# EAGLE design Mini_Matrix_v2 (EAGLE 6.1)
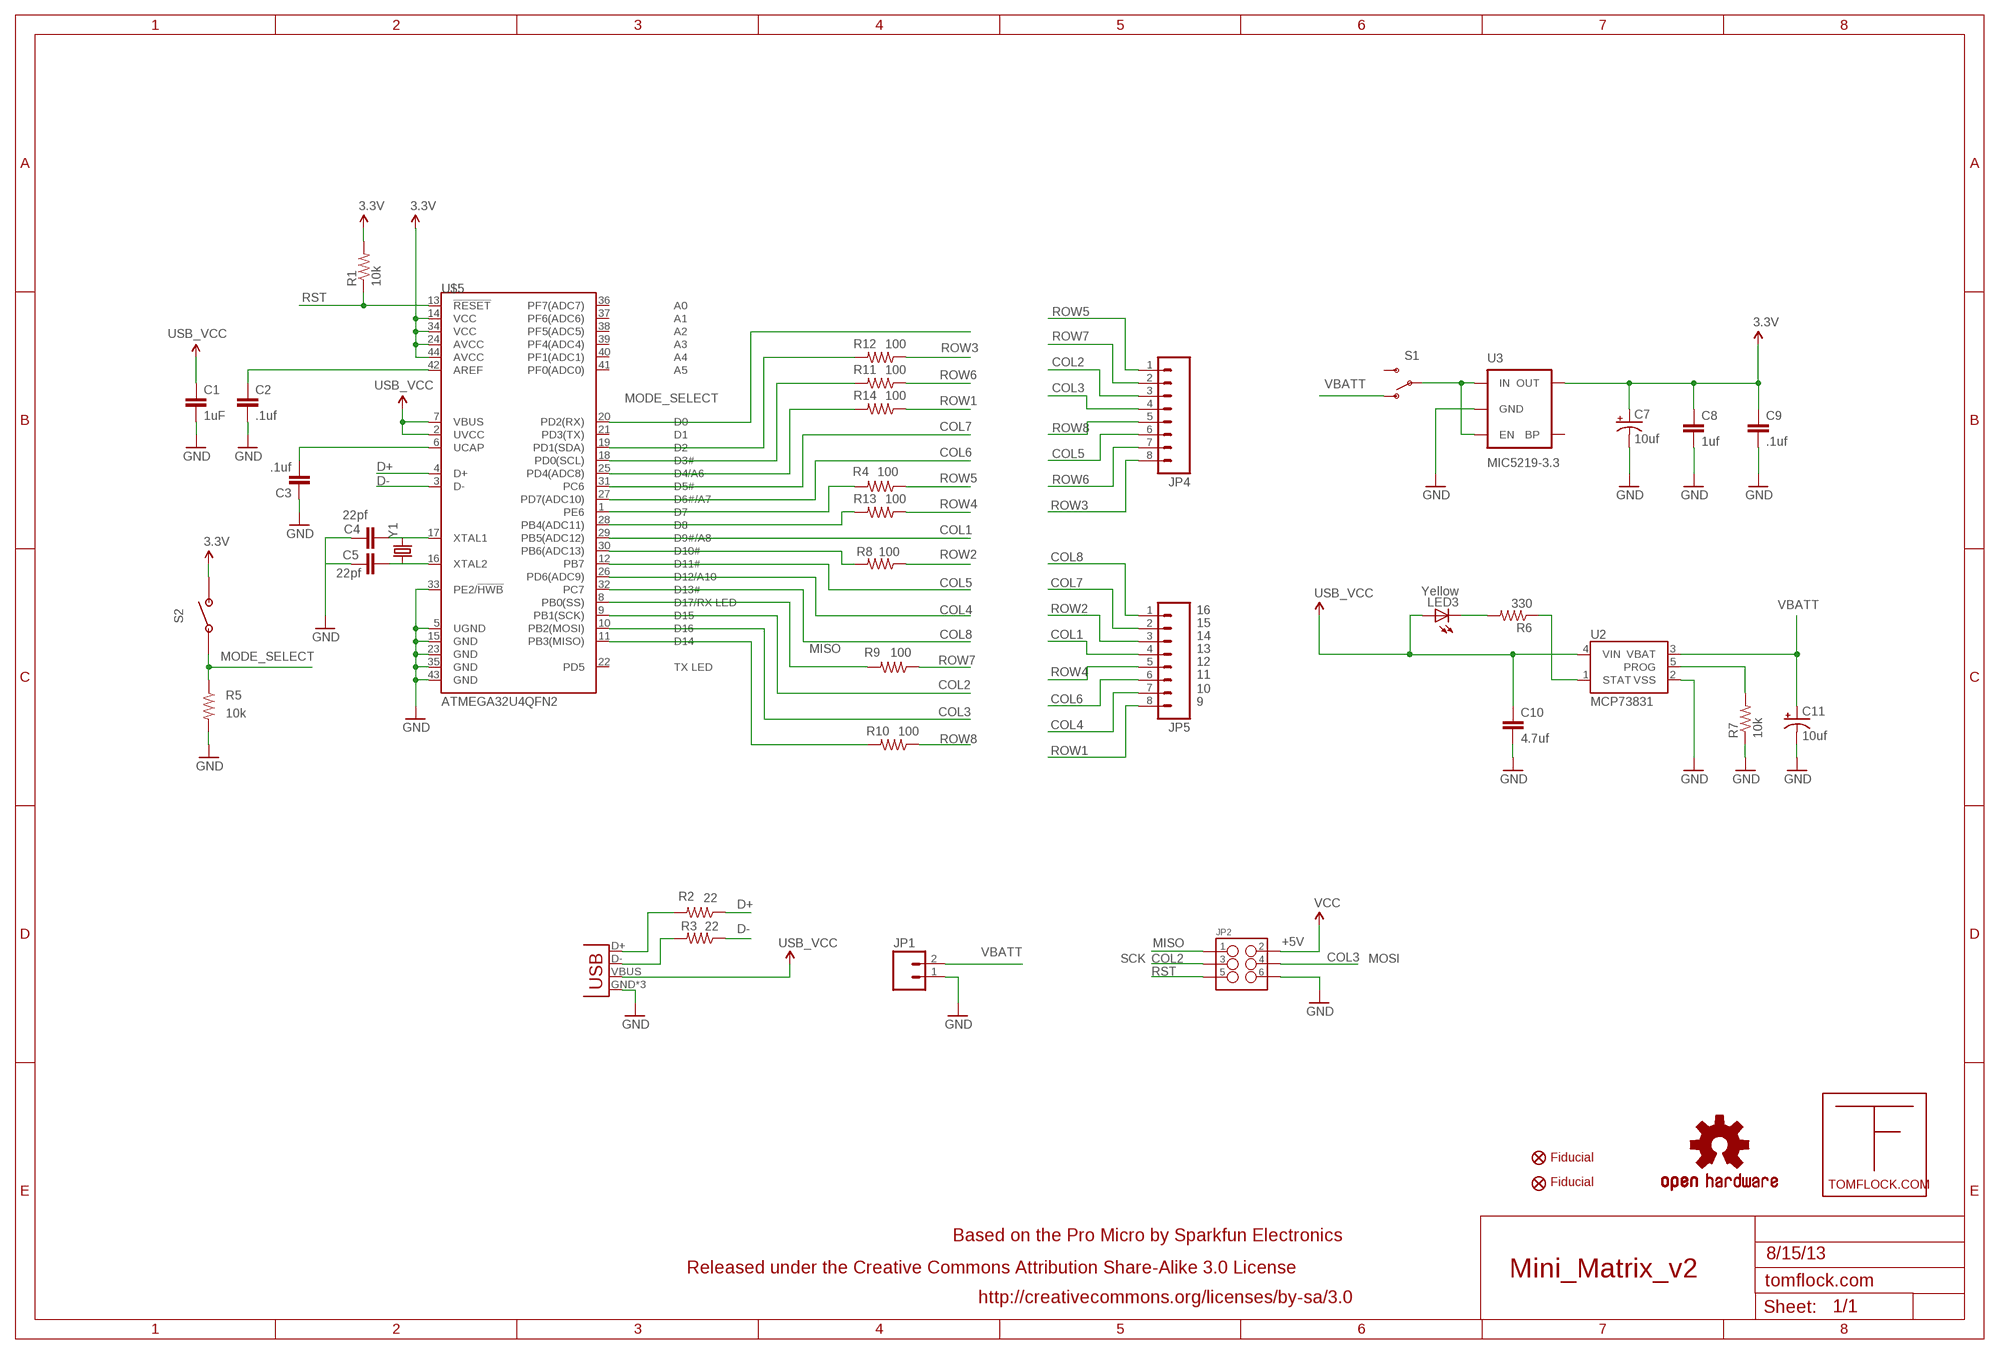
[diagram p0: schematic, sheet 1]

## Parts
C1  1uF  CAP0402-CAP  [0402-CAP]
C2  .1uf  CAP0402-CAP  [0402-CAP]
C3  .1uf  CAP0402-CAP  [0402-CAP]
C4  22pf  CAP0402-CAP  [0402-CAP]
C5  22pf  CAP0402-CAP  [0402-CAP]
C7  10uf  CAP_POL1206  [EIA3216]
C8  1uf  CAP0402-CAP  [0402-CAP]
C9  .1uf  CAP0402-CAP  [0402-CAP]
C10  4.7uf  CAP0402-CAP  [0402-CAP]
C11  10uf  CAP_POL1206  [EIA3216]
JP1  M02-JST-2-PTH-NO_SILK  [JST-2-PTH-NS]
JP2  M03X22X3_SILK_SM  [2X3]
JP3  USB-MICROB  [USB-MICROB]
JP4  M08SMD-STRAIGHT  [1X08_SMD]
JP5  M08SMD-STRAIGHT  [1X08_SMD]
JP6  FIDUCIAL1.5X3  [FIDUCIAL-1.5X3]
JP7  FIDUCIAL1.5X3  [FIDUCIAL-1.5X3]
LED3  Yellow  LED0603  [LED-0603]
R1  10k  RESISTOR0402-RES  [0402-RES]
R2  22  RESISTOR0402-RES  [0402-RES]
R3  22  RESISTOR0402-RES  [0402-RES]
R4  100  RESISTOR0402-RES  [0402-RES]
R5  10k  RESISTOR0402-RES  [0402-RES]
R6  330  RESISTOR0402-RES  [0402-RES]
R7  10k  RESISTOR0402-RES  [0402-RES]
R8  100  RESISTOR0402-RES  [0402-RES]
R9  100  RESISTOR0402-RES  [0402-RES]
R10  100  RESISTOR0402-RES  [0402-RES]
R11  100  RESISTOR0402-RES  [0402-RES]
R12  100  RESISTOR0402-RES  [0402-RES]
R13  100  RESISTOR0402-RES  [0402-RES]
R14  100  RESISTOR0402-RES  [0402-RES]
S1  SWITCH-SPST-SMD-A  [SWITCH-SPST-SMD-A]
S2  SWITCH-RIGHT-ANGLE-SMD  [SWITCH-RIGHT-ANGLE-SMD]
U2  MCP73831  [SOT23-5]
U3  MIC5219-3.3  V_REG_LDOSMD  [SOT23-5]
U$1  TFLOGO  [TFLOGO]
U$2  OSHW-LOGOS  [OSHW-LOGO-S]
U$5  ATMEGA32U4QFN2  [SPARKFUN-DIGITALIC_QFN-44-NOPAD]
Y1  CRYSTAL5X3  [CRYSTAL-SMD-5X3]

## Nets
3.3V: C7.A(+) C8.1 C9.1 JP2.2 R1.2 S2.2 U3.5(OUT) U$5.14(VCC) U$5.24(AVCC) U$5.34(VCC) U$5.44(AVCC) ; supply symbol labelled VCC
COL1: JP5.4 U$5.29(PB5(ADC12))
COL2: JP2.3 JP4.3 U$5.9(PB1(SCK))
COL3: JP2.4 JP4.4 U$5.10(PB2(MOSI))
COL4: JP5.7 U$5.26(PD6(ADC9))
COL5: JP4.6 U$5.12(PB7)
COL6: JP5.6 U$5.27(PD7(ADC10))
COL7: JP5.2 U$5.31(PC6)
COL8: JP5.1 U$5.32(PC7)
D+: R2.1 U$5.4(D+)
D-: R3.1 U$5.3(D-)
GND: C1.2 C2.2 C3.1 C4.1 C5.1 C7.C(-) C8.2 C9.2 C10.2 C11.C(-) JP1.1 JP2.6 JP3.GND JP3.MT1(GND) JP3.MT2(GND) R5.2 R7.1 U2.2(VSS) U3.2(GND) U$5.5(UGND) U$5.15(GND) U$5.23(GND) U$5.33(PE2/!HWB) U$5.35(GND) U$5.43(GND)
MISO: JP2.1 R10.2 U$5.11(PB3(MISO))
MODE_SELECT: R5.1 S2.1 U$5.20(PD2(RX))
N$1: S1.2(P) U3.1(IN) U3.3(EN)
N$2: C5.2 U$5.16(XTAL2) Y1.1
N$3: R7.2 U2.5(PROG)
N$4: C4.2 U$5.17(XTAL1) Y1.3
N$5: C2.1 U$5.42(AREF)
N$6: R6.1 U2.1(STAT)
N$7: LED3.C R6.2
N$8: C3.2 U$5.6(UCAP)
N$10: R4.2 U$5.1(PE6)
N$11: R9.2 U$5.8(PB0(SS))
N$12: R11.2 U$5.18(PD0(SCL))
N$13: R12.2 U$5.19(PD1(SDA))
N$14: JP3.D- R3.2
N$15: JP3.D+ R2.2
N$16: R8.2 U$5.30(PB6(ADC13))
N$17: R13.2 U$5.28(PB4(ADC11))
N$18: R14.2 U$5.25(PD4(ADC8))
ROW1: JP5.8 R14.1
ROW2: JP5.3 R8.1
ROW3: JP4.8 R12.1
ROW4: JP5.5 R13.1
ROW5: JP4.1 R4.1
ROW6: JP4.7 R11.1
ROW7: JP4.2 R9.1
ROW8: JP4.5 R10.1
RST: JP2.5 R1.1 U$5.13(!RESET)
VBATT: C11.A(+) JP1.2 S1.1(O) U2.3(VBAT)
VCC: C1.1 C10.1 JP3.VBUS LED3.A U2.4(VIN) U$5.2(UVCC) U$5.7(VBUS) ; supply symbol labelled USB_VCC
Unconnected: S1.3(S) U3.4(BP) U$5.21(PD3(TX)) U$5.22(PD5) U$5.36(PF7(ADC7)) U$5.37(PF6(ADC6)) U$5.38(PF5(ADC5)) U$5.39(PF4(ADC4)) U$5.40(PF1(ADC1)) U$5.41(PF0(ADC0))

## Notes on the sheet
- 16
- 15
- 14
- 13
- 12
- 11
- 10
- 9
- +5V
- SCK | MOSI
- Fiducial
- Fiducial
- Based on the Pro Micro by Sparkfun Electronics
- 8/15/13
- Released under the Creative Commons Attribution Share-Alike 3.0 License
- tomflock.com
- http://creativecommons.org/licenses/by-sa/3.0

## Library data of the parts
C1-C5 C8-C10 = SparkFun:CAP: Capacitor Standard 0603 ceramic capacitor, and 0.1" leaded capacitor.
C7 C11 = SparkFun:CAP_POL: Capacitor Polarized These are standard SMD and PTH capacitors. Normally 10uF, 47uF, and 100uF in electrolytic and tantalum varieties. Always verify the external diameter of the through hole cap, it varies with capacity, voltage, and manufacturer. The EIA devices should be standard.
JP1 = SparkFun:M02: Header 2 Standard 2-pin 0.1" header. Use with straight break away headers (SKU : PRT-00116), right angle break away headers (PRT-00553), swiss pins (PRT-00743), machine pins (PRT-00117), and female headers (PRT-00115). Molex polarized connector foot print use with SKU : PRT-08233 with associated crimp pins and housings.
JP2 = SparkFun-Connectors:M03X2: 2x3 .1" header. Shrouded, with keying- CONN-10681 SMT- CONN-11415 Pogo pins- HW-11044
JP3 = SparkFun-Connectors:USB: USB Connectors USB-B-PTH is fully proven SKU : PRT-00139/CONN-08278 USB-miniB is fully proven SKU : PRT-00587 USB-A-PCB is untested. USB-A-H is throughly reviewed, but untested. Spark Fun Electronics SKU : PRT-00437 USB-B-SMT is throughly reviewed, but untested. Needs silkscreen touching up. USB-A-S has not been used/tested USB-MB-H has not been used/tested USB-MICROB has been used. CONN-09505; PROD_ID: CONN-09505
JP4 JP5 = SparkFun-Connectors:M08: Header 8 Standard 8-pin 0.1" header. Use with straight break away headers (SKU : PRT-00116), right angle break away headers (PRT-00553), swiss pins (PRT-00743), machine pins (PRT-00117), and female headers (PRT-00115).
JP6 JP7 = SparkFun:FIDUCIAL: Fiducial Alignment Points Various fiducial points for machine vision alignment.
LED3 = SparkFun:LED: LEDs Standard schematic elements and footprints for 5mm, 3mm, 1206, and 0603 sized LEDs. 5mm - Spark Fun Electronics SKU : COM-00529 (and others)
R1-R14 = SparkFun:RESISTOR: Resistor Basic schematic elements and footprints for 0603, 1206, and PTH resistors.
S1 = SparkFun:SWITCH-SPST: SPST Switch Simple slide switch. Spark Fun Electronics SKU : COM-00102
S2 = TOM1:SWITCH-RIGHT-ANGLE-SMD: B3U-3000P SWITCH TACTILE SPST-NO 0.05A 12V
U2 = SparkFun:MCP73831: Microchip's MCP73831 Miniature single cell, fully integrated Li-Ion, Li-polymer charge management controller http://ww1.microchip.com/downloads/en/DeviceDoc/21984a.pdf
U3 = SparkFun:V_REG_LDO: Voltage Regulator LDO Standard 150mA LDO voltage regulator in SOT-23 layout. Micrel part MIC5205. BP (by-pass) pin is used to lower output noise with 470pF cap.
U$1 = TOM1:TFLOGO
U$2 = SparkFun:OSHW-LOGO: Open Source Hardware Logo This logo indicates the piece of hardware it is found on incorporates a OSHW license and/or adheres to the definition of open source hardware found here: http://freedomdefined.org/OSHW
U$5 = SparkFun-DigitalIC:ATMEGA32U4: Atmel 44-pin 8-bit Microcontroller with 32KBytes of ISP Flash and USB Controller ----- Please use the QFN-44-NOPAD_1:1 package for the footprint of all boards using a 32U4. Route traces directly away from the pads as much as possible.
Y1 = SparkFun:CRYSTAL: Crystals Various standard crystals. Proven footprints. Spark Fun Electronics SKU : COM-00534

## Board
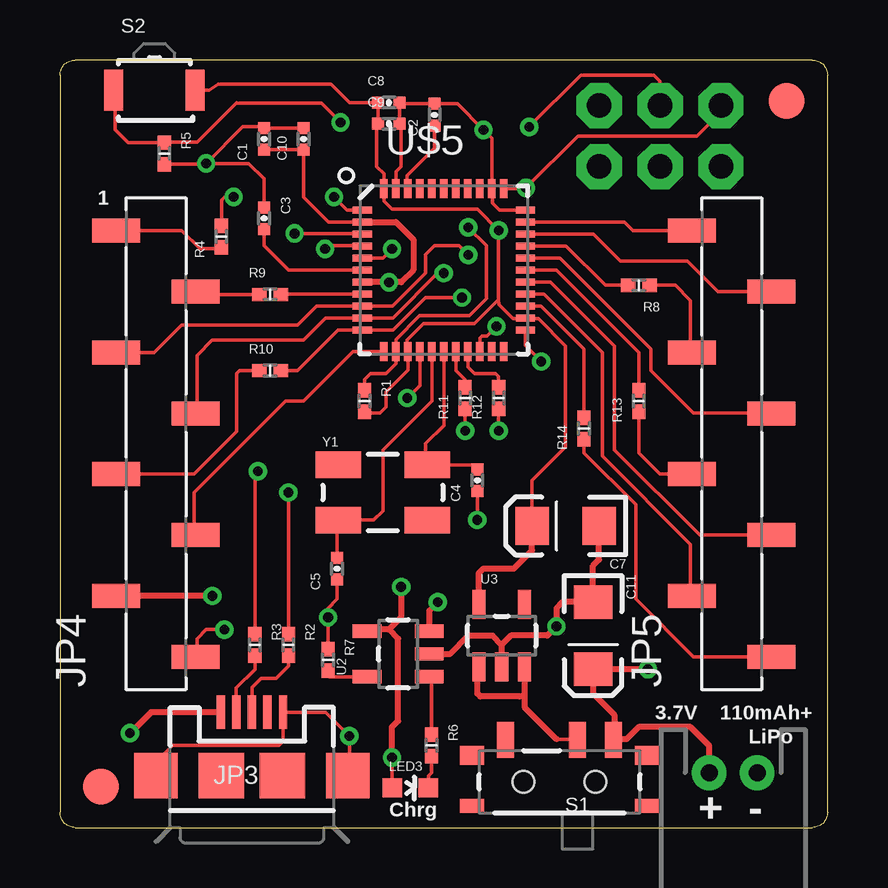
[diagram p1: board, top side]
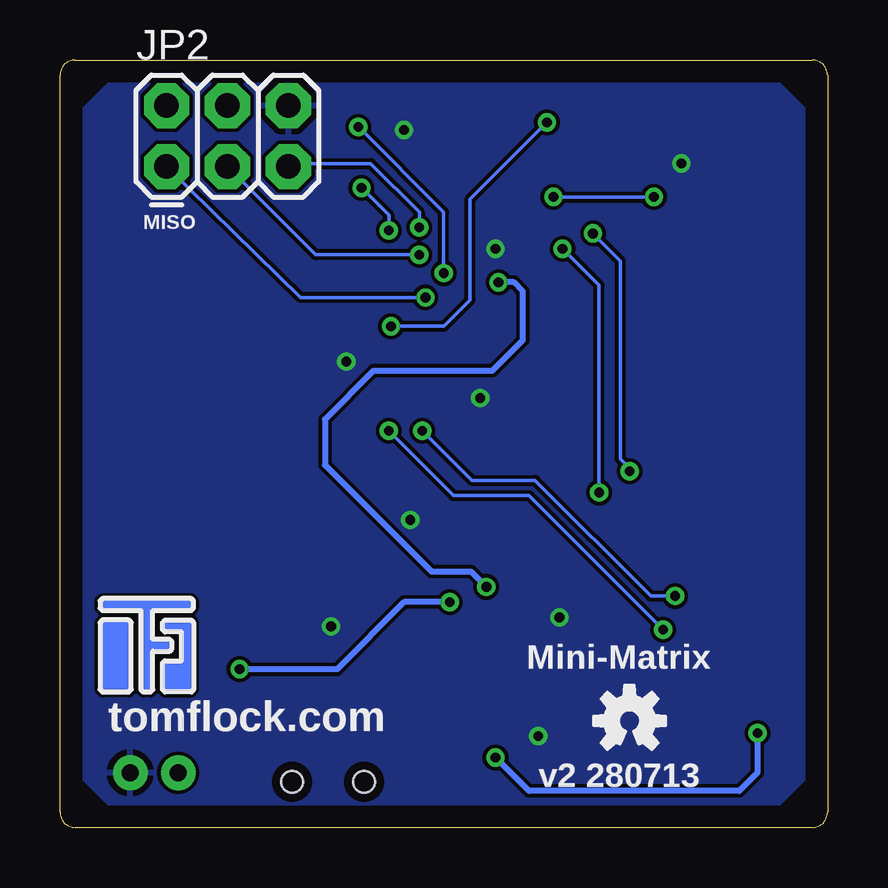
[diagram p2: board, bottom side, seen from below]

Size 32 x 32 mm. Coordinates in mm from the lower left corner, seen from the top.
Outline: 0.64,0 31.36,0 arc90 32,0.64 32,31.36 arc90 31.36,32 0.64,32 arc90 0,31.36 0,0.64 arc90 0.64,0
Copper layers (1*16): Top 0.0356mm / dielectric 1.5011mm / Bottom 0.0356mm
Design rules: minimum track width 6mil, minimum drill 13mil, track to track 6mil, track to pad 6mil, pad to pad 6mil, via to via 6mil, smd to smd 6mil, copper to edge 15mil, drill to drill 6mil, minimum pad ring 7mil, minimum via ring 7mil, stop-mask expansion 4mm, vias tented up to drill 4mm, thermal gap 10mil

### Footprints (pad centres in the part's own frame; a part is rotated, then mirrored left to right if it is on the bottom)
0402-CAP = smd 0.5 x 0.5: 1 -0.45,0; 2 0.45,0
EIA3216 = smd 1.4 x 1.6: A 1.4,0; C -1.4,0
JST-2-PTH-NS = drill 0.7 pad 1.448: 1 -1,0; 2 1,0
2X3 = drill 1.016 pad 1.88 octagon: 1 0,0; 2 0,2.54; 3 2.54,0; 4 2.54,2.54; 5 5.08,0; 6 5.08,2.54
USB-MICROB = smd 0.35 x 1.4: D+ 0,2.65; D- -0.65,2.65; GND 1.3,2.65; ID 0.65,2.65; VBUS -1.3,2.65 | smd 1.8 x 1.9: MT1 -4,0; MT2 4,0 | smd 1.9 x 1.9: P$1 -1.27,0; P$2 1.27,0
1X08_SMD = smd 1 x 2: 1 0,1.65; 2 -2.54,-1.65; 3 -5.08,1.65; 4 -7.62,-1.65; 5 -10.16,1.65; 6 -12.7,-1.65; 7 -15.24,1.65; 8 -17.78,-1.65
FIDUCIAL-1.5X3 = smd 1.5 x 1.5: 1 0,0
LED-0603 = smd 0.8 x 0.8: A 0,-0.75; C 0,0.75
0402-RES = smd 0.6 x 0.55: 1 -0.45,0; 2 0.45,0
SWITCH-SPST-SMD-A = smd 0.7 x 1.5: 1 -2.25,-1.75; 2 -0.75,-1.75; 3 2.25,-1.75 | smd 1 x 0.6: GND1 -3.65,1; GND3 3.65,1 | smd 1 x 0.8: GND2 -3.65,-1.1; GND4 3.65,-1.1 | hole 0.9: -1.5,0; 1.5,0
SWITCH-RIGHT-ANGLE-SMD = smd 0.8 x 1.7: 1 -1.7,0; 2 1.7,0
SOT23-5 = smd 0.55 x 1.2: 1 -0.95,-1.3; 2 0,-1.3; 3 0.95,-1.3; 4 0.95,1.3; 5 -0.95,1.3
SPARKFUN-DIGITALIC_QFN-44-NOPAD = smd 0.8 x 0.3: 1 -3.4,2.5; 2 -3.4,2; 3 -3.4,1.5; 4 -3.4,1; 5 -3.4,0.5; 6 -3.4,0; 7 -3.4,-0.5; 8 -3.4,-1; 9 -3.4,-1.5; 10 -3.4,-2; 11 -3.4,-2.5; 23 3.4,-2.5; 24 3.4,-2; 25 3.4,-1.5; 26 3.4,-1; 27 3.4,-0.5; 28 3.4,0; 29 3.4,0.5; 30 3.4,1; 31 3.4,1.5; 32 3.4,2; 33 3.4,2.5 | smd 0.3 x 0.8: 12 -2.5,-3.4; 13 -2,-3.4; 14 -1.5,-3.4; 15 -1,-3.4; 16 -0.5,-3.4; 17 0,-3.4; 18 0.5,-3.4; 19 1,-3.4; 20 1.5,-3.4; 21 2,-3.4; 22 2.5,-3.4; 34 2.5,3.4; 35 2,3.4; 36 1.5,3.4; 37 1,3.4; 38 0.5,3.4; 39 0,3.4; 40 -0.5,3.4; 41 -1,3.4; 42 -1.5,3.4; 43 -2,3.4; 44 -2.5,3.4
CRYSTAL-SMD-5X3 = smd 1.9 x 1.1: 1 -1.85,-1.15; 2 1.85,-1.15; 3 1.85,1.15; 4 -1.85,1.15

### Placement (x,y rotation side)
C1  8.51,28.7 90 top
C2  15.62,29.72 90 top
C3  8.51,25.4 270 top
C4  17.4,14.48 90 top
C5  11.56,10.79 90 top
C7  21.08,12.57 180 top
C8  13.72,30.23 0 top
C9  13.72,29.34 0 top
C10  10.16,28.7 90 top
C11  22.23,8 270 top
JP1  28.07,2.29 180 top
JP2  27.56,27.56 0 bottom
JP3  8,2.16 0 top
JP4  4,24.89 90 top
JP5  28,24.89 90 top
JP6  30.3,30.3 0 top
JP7  1.7,1.7 0 top
LED3  14.61,1.65 270 top
R1  12.7,17.78 270 top
R2  9.53,7.62 270 top
R3  8.13,7.62 270 top
R4  6.73,24.64 90 top
R5  4.36,28.1 270 top
R6  15.49,3.43 270 top
R7  11.18,6.99 270 top
R8  24.13,22.61 180 top
R9  8.76,22.23 0 top
R10  8.76,19.05 0 top
R11  16.89,17.91 90 top
R12  18.29,17.91 90 top
R13  24.13,17.78 90 top
R14  21.84,16.64 90 top
S1  20.83,1.91 180 top
S2  3.94,30.73 0 top
U2  14.1,7.24 90 top
U3  18.41,8 0 top
U$1  28.33,7.25 0 bottom
U$2  8.26,4.45 0 bottom
U$5  16,23.24 0 top
Y1  13.46,13.97 0 top

### Tracks (layer width: path | path; a pad name or v marks a point on that pad's centre or on a via)
3.3V  (via drill 0.41)
  Top 0.152: 18.29,22.01 18.3,21.8 18.89,21.21 19.37,21.21 U$5.24 19.43,21.21 19.94,21.21 21.08,20.07 21.08,15.88 19.68,14.47 C7.A | S2.2 6.22,30.73 6.6,30.99 11.3,30.99 12.06,30.23 C8.1 C9.1 13.21,29.15 13.21,27.56 13.5,27.27 U$5.44 13.5,26.12 13.84,25.78 17.4,25.78 v18.29,24.89 18.29,22.01 | R1.2 12.76,17.27 13.34,17.27 13.59,17.53 13.59,18.16 14.5,19.07 U$5.14 14.48,19.86 14.48,20.32 15.16,21 17.28,21 18.29,22.01 | JP2.2 27.56,29.84 26.54,28.83 21.59,28.83 v19.43,26.67 19.4,26.64 U$5.34
  Top 0.254: U3.5 17.46,10.61 17.65,10.79 18.92,10.79 19.68,11.56 C7.A
  Bottom 0.152: v19.43,26.67 18.29,25.53 v18.29,24.89
COL1
  Top 0.152: U$5.29 20.84,23.74 24.64,19.94 24.64,19.05 26.42,17.27 JP5.4
COL2  (via drill 0.41)
  Top 0.152: JP4.3 3.94,19.81 5.08,20.95 9.91,20.95 10.69,21.74 U$5.9 13.87,21.74 15.24,23.11 15.24,23.88 15.62,24.26 16.64,24.26 v17.02,23.88
  Bottom 0.152: v17.02,23.88 21.34,23.88 JP2.3
COL3  (via drill 0.41)
  Top 0.152: U$5.10 11.08,21.24 10.16,20.32 6.35,20.32 5.71,19.68 5.71,17.34 JP4.4 | 12.63,21.21 U$5.10 | U$5.10 13.88,21.24 15.75,23.11 v16,23.11 | v19.56,29.21 21.72,31.37 24.77,31.37 25.02,31.11 JP2.4
  Bottom 0.152: v16,23.11 16,25.65 v19.56,29.21
COL4
  Top 0.152: U$5.26 20.18,22.24 22.61,19.81 22.61,15.49 26.29,11.81 26.29,9.71 JP5.7
COL5
  Top 0.152: U$5.12 12.22,19.84 10.16,17.78 9.4,17.78 5.59,13.97 5.59,12.25 JP4.6
COL6
  Top 0.152: U$5.27 20.44,22.74 23.11,20.07 23.11,15.75 26.67,12.19 JP5.6
COL7
  Top 0.152: U$5.31 22.25,24.74 23.37,23.62 26.16,23.62 27.43,22.35 JP5.2
COL8
  Top 0.152: U$5.32 23.53,25.24 23.88,24.89 JP5.1
D+  (via drill 0.41)
  Top 0.152: R2.1 v9.53,13.97 | v11.05,24.13 11.18,24.26 12.59,24.26 U$5.4
  Bottom 0.152: v9.53,13.97 9.53,22.61 v11.05,24.13
D-  (via drill 0.41)
  Top 0.152: v9.78,24.77 12.58,24.77 U$5.3 | R3.1 8.13,14.73 v8.26,14.86
  Bottom 0.152: v8.26,14.86 8.26,14.99 8.64,15.37 8.64,23.62 v9.78,24.77
GND  (via drill 0.41)
  Top 0.152: U$5.33 18.33,25.74 18.03,26.04 18.03,26.61 U$5.35 18,28.73 v17.65,29.08 16.57,30.17 C2.2 14.22,30.17 C8.2 C9.2 | 13.97,26.61 U$5.43 14,27.34 14.22,27.56 14.22,29.28 C9.2 | C10.2 C1.2 8.45,29.21 7.62,29.21 v6.1,27.69 | JP3.MT2 12.06,1.97 v12.06,3.81 11.07,4.81 JP3.GND 9.3,3.59 9.14,3.43 4.7,3.43 4.06,2.79 4.06,1.97 JP3.MT1 | U$5.23 19.4,20.09 v20.07,19.43 | R7.1 v11.18,8.76 11.18,9.14 11.56,9.53 C5.1 | C7.C | C4.1 v17.4,12.83 | U$5.15 15,18.43 v14.48,17.91 | U$5.5 13.46,23.75 v13.84,24.13 | R5.2 6.06,27.65 v6.1,27.69 | C3.1 8.51,27.05 7.87,27.69 v6.1,27.69 | 14.22,29.15 C9.2
  Top 0.254: C7.C 22.48,11.18 22.23,10.92 C11.C 20.96,9.4 20.7,9.14 v20.7,8.38 20.32,8 18.8,8 18.41,7.62 | 18.41,7.62 U3.2 | U2.2 16.26,7.24 17.02,8 18.03,8 18.41,7.62
  pour Bottom: 1,30 1,2 2,1 30,1 31,2 31,30 30,31 2,31
MISO  (via drill 0.41)
  Top 0.152: R10.2 9.91,19.05 11.6,20.74 U$5.11 13.88,20.74 15.24,22.1 v16.76,22.1
  Bottom 0.152: v16.76,22.1 21.97,22.1 JP2.1
MODE_SELECT  (via drill 0.41)
  Top 0.152: 2.27,30.57 S2.1 2.3,30.54 2.3,29.1 2.85,28.55 R5.1 4.38,28.57 5.71,28.57 7.37,30.23 7.39,30.2 10.9,30.2 v11.7,29.4 | U$5.20 17.5,20.4 17.6,20.5 17.8,20.5 v18.2,20.9
  Bottom 0.152: v18.2,20.9 16,20.9 14.9,22 14.9,26.2 v11.7,29.4
N$1
  Top 0.152: 19.36,5.65 19.18,5.46 | 17.4,6.63 U3.1 | 20.7,3.68 21.55,3.68 S1.2
  Top 0.254: U3.3 19.36,5.65 19.36,5.02 20.7,3.68 | 19.18,5.46 17.53,5.46 17.4,5.59 17.4,6.63
N$2
  Top 0.152: U$5.16 15.5,17.79 13.46,15.75 13.46,13.21 13.08,12.83 Y1.1 11.56,12.77 C5.2
N$3
  Top 0.152: U2.5 11.22,6.29 R7.2
N$4
  Top 0.152: U$5.17 16,16.76 15.24,16 15.24,15.19 Y1.3 17.39,15.12 C4.2
N$5
  Top 0.152: C2.1 15.62,28.32 14.48,27.18 14.48,26.66 U$5.42
N$6
  Top 0.152: R6.1 15.49,6.19 U2.1
N$7
  Top 0.152: LED3.C 15.36,2.15 15.49,2.29 R6.2
N$8
  Top 0.152: U$5.6 9.53,23.24 8.51,24.26 C3.2
N$10  (via drill 0.41)
  Top 0.152: U$5.1 11.98,25.74 v11.43,26.29 | v7.24,26.29 6.86,26.29 6.73,26.16 R4.2
  Bottom 0.152: v11.43,26.29 v7.24,26.29
N$11
  Top 0.152: U$5.8 9.43,22.24 R9.2
N$12
  Top 0.152: U$5.18 16.5,19.06 16.89,18.67 R11.2
N$13
  Top 0.152: U$5.19 17,19.19 17.27,18.92 18.16,18.92 18.29,18.8 R12.2
N$14
  Top 0.152: JP3.D- 7.35,5.83 8.13,6.6 R3.2
N$15
  Top 0.152: JP3.D+ 8,5.84 8.38,6.22 9.02,6.22 9.53,6.73 R2.2
N$16
  Top 0.152: U$5.30 21.1,24.24 22.73,22.61 R8.2
N$17
  Top 0.152: U$5.28 20.7,23.24 24.13,19.81 R13.2
N$18
  Top 0.152: U$5.25 20.04,21.74 21.84,19.94 R14.2
ROW1
  Top 0.152: JP5.8 26.42,7.11 24,9.53 24,13.46 21.84,15.62 R14.1
ROW2
  Top 0.152: R8.1 25.65,22.61 26.29,21.97 26.29,19.87 JP5.3
ROW3  (via drill 0.41)
  Top 0.152: R12.1 v18.29,16.54 | v6.86,8.26 6.1,8.26 5.71,7.87 5.71,7.17 JP4.8
  Bottom 0.152: v18.29,16.54 15.59,13.84 12.45,13.84 v6.86,8.26
ROW4
  Top 0.152: R13.1 24.13,15.62 25.02,14.73 JP5.5
ROW5
  Top 0.152: JP4.1 5.08,24.89 5.84,24.13 6.42,24.13 R4.1
ROW6  (via drill 0.41)
  Top 0.152: R11.1 v16.89,16.54
  Top 0.254: v6.35,9.65 JP4.7
  Bottom 0.152: v16.89,16.54 14.83,14.48 12.19,14.48 7.37,9.65 v6.35,9.65
ROW7
  Top 0.152: R9.1 5.78,22.23 JP4.2
ROW8
  Top 0.152: R10.1 7.49,19.05 7.37,18.92 7.37,16.51 5.59,14.73 JP4.5
RST  (via drill 0.41)
  Top 0.152: R1.1 12.7,18.67 12.95,18.92 13.59,18.92 14,19.34 U$5.13 14,20.35 14.99,21.34 17.07,21.34 17.78,22.04 17.78,24.26 v17.02,25.02
  Bottom 0.152: JP2.5 21.97,27.56 21.84,27.69 19.05,27.69 17.02,25.65 v17.02,25.02
VBATT  (via drill 0.41)
  Top 0.152: 23.11,3.68 S1.1 23.11,3.69 | C11.A
  Top 0.254: JP1.2 27.07,3.41 26.29,4.19 24.13,4.19 23.62,3.68 23.11,3.68 | C11.A 22.23,5.59 23.11,4.7 23.11,3.69 | U2.3 15.4,9.05 v15.75,9.4 | v24.51,6.6 C11.A
  Bottom 0.254: v15.75,9.4 17.65,9.4 20.45,6.6 v24.51,6.6
VCC  (via drill 0.41)
  Top 0.152: C1.1 C10.1 | 10.18,28.07 C10.1 | v13.84,2.92 13.84,1.66 LED3.A | 12.86,8.26 U2.4 | U$5.7 | U$5.2 11.21,25.24 10.16,26.29 C10.1
  Top 0.254: JP3.VBUS 3.79,4.81 v2.92,3.94 | v13.84,2.92 13.84,4.19 14.1,4.45 14.1,7.87 13.72,8.26 | 13.72,8.26 12.86,8.26 | U$5.2 14,25.24 14.73,24.51 14.73,23.24 14.22,22.73 v13.72,22.73 U$5.7 | v14.22,10.03 14.22,8.76 13.72,8.26
  Bottom 0.254: v2.92,3.94 2.92,2.29 3.68,1.52 12.45,1.52 v13.84,2.92 | v14.22,10.03 14.86,10.67 16.51,10.67 20.95,15.11 20.95,17.02 18.92,19.05 13.97,19.05 12.7,20.32 12.7,22.35 13.08,22.73 v13.72,22.73

### Text on the board
tPlace: 1 | 3.7V | 110mAh+ | LiPo | Chrg | + | -
bPlace: MISO | Mini-Matrix | tomflock.com | v2 280713